# Altium schematic sheet Bluetooth.SchDoc
size A4
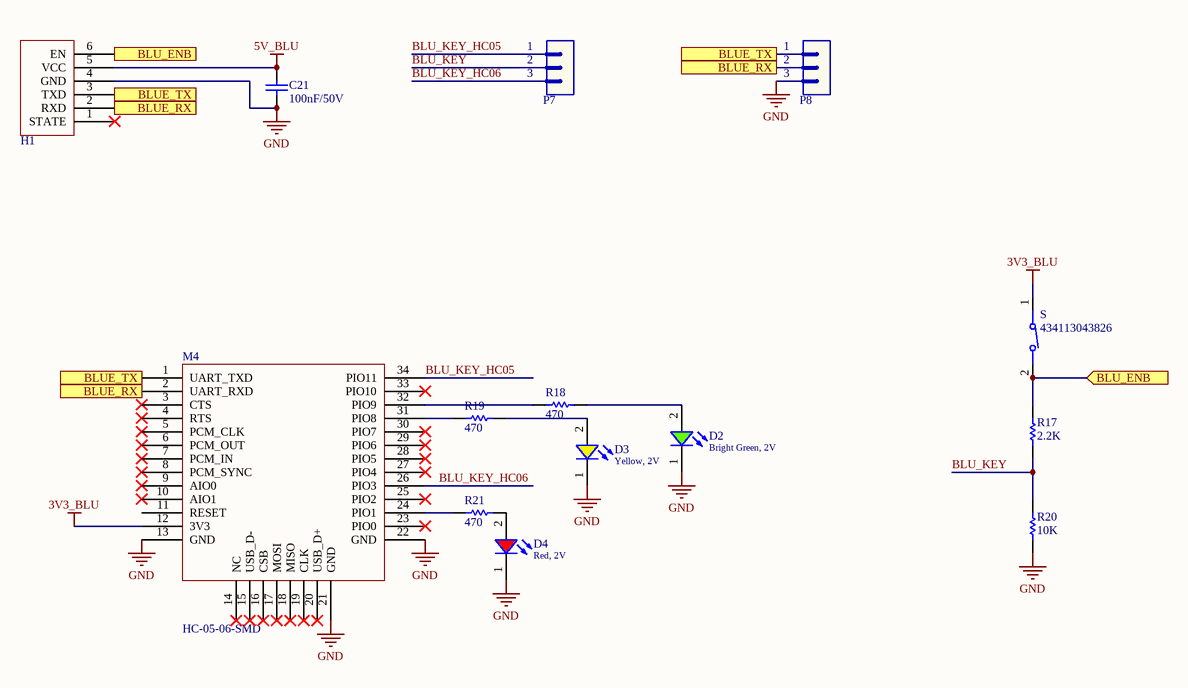
[diagram p0: Bluetooth.SchDoc]

## Parts
C21  value 100nF/50V  [CAP-SM-0805]  (hidden comment: Cap-100nF-50V-0805)
D2  Bright Green, 2V  [WL-SMCW_0805]
D3  Yellow, 2V  [WL-SMCW_0805]
D4  Red, 2V  [WL-SMCW_0805]
H1  HC-05-06-TH  [HC-05-06-TH]  (value not drawn)
M4  HC-05-06-SMD  [HC-05-06-SMD]
P7  Header 3  [JP3]  (value not drawn)
P8  Header 3  [JP3]  (value not drawn)
R17  value 2.2K  [RES-SM-0805]  (hidden comment: Res-2.2K-0805)
R18  value 470  [RES-SM-0805]  (hidden comment: Res-470-0805)
R19  value 470  [RES-SM-0805]  (hidden comment: Res-470-0805)
R20  value 10K  [RES-SM-0805]  (hidden comment: Res-10k-0805)
R21  value 470  [RES-SM-0805]  (hidden comment: Res-470-0805)
S  434113043826  [434113043826]

## Ports
BLU_ENB (in), BLU_ENB (out), BLUE_RX (in), BLUE_RX (out), BLUE_TX (in)

## Nets
3V3_BLU: M4.12(3V3) S.1
5V_BLU: C21.2 H1.5(VCC)
GND: C21.1 D2.1(K) D3.1(K) D4.1(K) H1.4(GND) M4.13(GND) M4.21(GND) M4.22(GND) P8.3 R20.1
BLU_ENB: H1.6(EN) R17.2 S.2 ; port BLU_ENB
BLU_KEY: P7.2 R17.1 R20.2
BLU_KEY_HC05: M4.34(PIO11) P7.1
BLU_KEY_HC06: M4.26(PIO3) P7.3
BLUE_RX: H1.2(RXD) M4.2(UART_RXD) P8.2 ; port BLUE_RX
BLUE_TX: H1.3(TXD) M4.1(UART_TXD) P8.1 ; port BLUE_TX
NetD2_2: D2.2(A) R18.2
NetD3_2: D3.2(A) R19.2
NetD4_2: D4.2(A) R21.2
NetM4_24: M4.24(PIO1) R21.1
NetM4_31: M4.31(PIO8) R19.1
NetM4_32: M4.32(PIO9) R18.1

Not connected (* = marked no-connect by the designer): H1 1(STATE)*; M4 3(CTS)* 4(RTS)* 5(PCM_CLK)* 6(PCM_OUT)* 7(PCM_IN)* 8(PCM_SYNC)* 9(AIO0)* 10(AIO1)* 11(RESET) 14(NC)* 15(USB_D-)* 16(CSB)* 17(MOSI)* 18(MISO)* 19(CLK)* 20(USB_D+)* 23(PIO0)* 25(PIO2)* 27(PIO4)* 28(PIO5)* 29(PIO6)* 30(PIO7)* 33(PIO10)*

## Library data of the parts
C21 = Cap-100nF-50V-0805: CAP CER 0.1UF 50V Y5V 0805; Manufacturer: Samsung Electro-Mechanics; Manufacturer Part Number: CL21F104ZBCNNNC; Local Supplier: thegioiic; Local Supplier Link: https://thegioiic.com/products/tu-100nf-0-1uf-50v-0805; Supplier 1: Digikey; Supplier 1 Part Number: 1276-1007-1-ND; Supplier 1 Link: https://www.digikey.com/product-detail/en/samsung-electro-mechanics/CL21F104ZBCNNNC/1276-1007-1-ND/3889093
D2 = 150080VS75000: WL-SMCW SMT Mono-color Chip LED Waterclear, size 0805, Bright Green, 2V, 140deg; Chip Technology: AlInGaP; Dominant Wavelength typ.: 570nm; Luminous Intensity typ.: 40mcd; Peak Wavelength typ.: 572nm; Viewing Angle: 140deg; ComponentLink1Description: Manufacturer; ComponentLink1URL: http://www.we-online.de; ComponentLink2URL: https://www.we-online.com/catalog/datasheet/150080VS75000.pdf; ComponentLink2Description: Datasheet; Forward Voltage typ.: 2V; Emitting Color: Bright Green; Mounting Technology: SMT; Operating Temperature: -40 to +85degC; Published Date: December 2019; Part Number: 150080VS75000; Packaging: Tape and Reel; Size: 0805; Publisher: Wurth Elektronik
D3 = 150080YS75000: WL-SMCW SMT Mono-color Chip LED Waterclear, size 0805, Yellow, 2V, 140deg; Chip Technology: AlInGaP; Dominant Wavelength typ.: 590nm; Luminous Intensity typ.: 120mcd; Peak Wavelength typ.: 595nm; Viewing Angle: 140deg; ComponentLink1Description: Manufacturer; ComponentLink1URL: http://www.we-online.de; ComponentLink2URL: https://www.we-online.com/catalog/datasheet/150080YS75000.pdf; ComponentLink2Description: Datasheet; Forward Voltage typ.: 2V; Emitting Color: Yellow; Mounting Technology: SMT; Operating Temperature: -40 to +85degC; Published Date: December 2019; Part Number: 150080YS75000; Packaging: Tape and Reel; Size: 0805; Publisher: Wurth Elektronik
D4 = 150080RS75000: WL-SMCW SMT Mono-color Chip LED Waterclear, size 0805, Red, 2V, 140deg; Chip Technology: AlInGaP; Dominant Wavelength typ.: 625nm; Luminous Intensity typ.: 150mcd; Peak Wavelength typ.: 630nm; Viewing Angle: 140deg; ComponentLink1Description: Manufacturer; ComponentLink1URL: http://www.we-online.de; ComponentLink2URL: https://www.we-online.com/catalog/datasheet/150080RS75000.pdf; ComponentLink2Description: Datasheet; Forward Voltage typ.: 2V; Emitting Color: Red; Mounting Technology: SMT; Operating Temperature: -40 to +85degC; Published Date: December 2019; Part Number: 150080RS75000; Packaging: Tape and Reel; Size: 0805; Publisher: Wurth Elektronik
P7 P8 = Header 3: Header, 3-Pin; LatestRevisionDate: 17-Jul-2002; LatestRevisionNote: Re-released for DXP Platform.; Publisher: Altium Limited
R17 = Res-2.2K-0805: RES SMD 2.2K OHM 1% 1/8W 0805; Manufacturer: TE Connectivity Passive Product; Manufacturer Part Number: CRG0805F2K2; Local Supplier: thegioiic; Local Supplier Link: https://thegioiic.com/products/dien-tro-2-2k-ohm-0805-5; Supplier 1: Digikey; Supplier 1 Link: https://www.digikey.com/product-detail/en/te-connectivity-passive-product/CRG0805F2K2/A106060CT-ND/3477706; Supplier 1 Part Number: A106060CT-ND
R18 R19 R21 = Res-470-0805: RES 470 OHM JUMPER 0805; Manufacturer: YAG6006CT-ND; Manufacturer Part Number: PE0805FRF7W0R047L; Local Supplier: thegioiic; Local Supplier Link: https://www.thegioiic.com/products/dien-tro-470-kohm-0805-5; Supplier 1: Digikey; Supplier 1 Link: https://www.digikey.com/product-detail/en/yageo/PE0805FRF7W0R047L/YAG6006CT-ND/9696460; Supplier 1 Part Number: YAG6006CT-ND
R20 = Res-10k-0805: RES 10K OHM 1% 1/4W 0805; Manufacturer: Stackpole Electronics Inc; Manufacturer Part Number: RNCP0805FTD10K0; Local Supplier: thegioiic; Local Supplier Link: https://thegioiic.com/products/dien-tro-10k-ohm-0805-5; Supplier 1: Digikey; Supplier 1 Link: https://www.digikey.com/product-detail/en/stackpole-electronics-inc/RNCP0805FTD10K0/RNCP0805FTD10K0CT-ND/2240601; Supplier 1 Part Number: RNCP0805FTD10K0CT-ND
S = 434113043826: SWITCH TACTILE SPST-NO 0.05A 12V; MF: WÃ¼rth Elektronik; Package: None; Value: *; MP: 434113043826; Availability: Unavailable; SnapEDA_Link: https://www.snapeda.com/parts/434113043826/W%C3%BCrth%20Elektronik/view-part/4797567/?ref=snap; Price: None
H1 = HC-05-06-TH: Local Supplier: HShop; Local Supplier Link: https://hshop.vn/products/mach-thu-phat-bluetooth-hc-06-do-ra-chon-slave; Local Supplier Part Number: HS000882; Manufacturer: *; Manufacturer Part Number: *
M4 = HC-05-06-SMD: Local Supplier: HShop; Local Supplier Link: https://hshop.vn/products/mach-thu-phat-bluetooth-hc-06-chua-ra-chon-slave; Local Supplier Part Number: HS000881; Manufacturer: *; Manufacturer Part Number: *